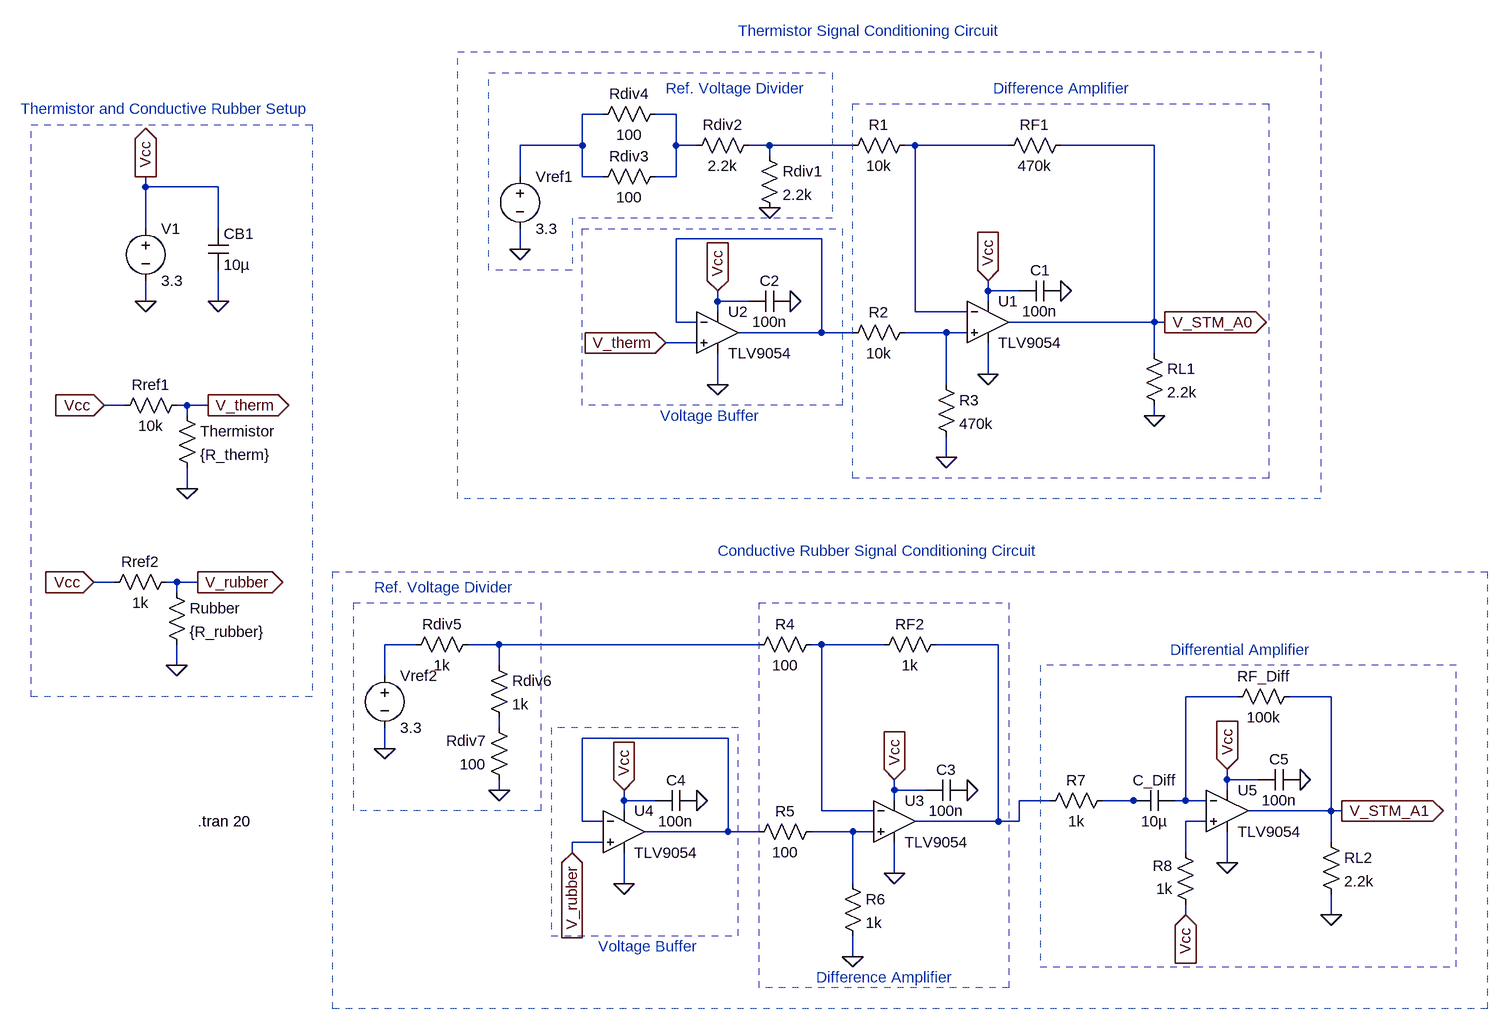
[diagram p0: schematic complete_circuit.asc]
complete_circuit.asc, the LTspice schematic file:
Version 4
SHEET 1 1320 1188
WIRE -176 -192 -208 -192
WIRE -64 -192 -96 -192
WIRE -208 -144 -208 -192
WIRE -208 -144 -304 -144
WIRE -64 -144 -64 -192
WIRE -32 -144 -64 -144
WIRE 80 -144 48 -144
WIRE 208 -144 80 -144
WIRE 304 -144 288 -144
WIRE 448 -144 304 -144
WIRE 672 -144 528 -144
WIRE 80 -128 80 -144
WIRE -304 -96 -304 -144
WIRE -208 -96 -208 -144
WIRE -176 -96 -208 -96
WIRE -64 -96 -64 -144
WIRE -64 -96 -96 -96
WIRE -880 -80 -880 -96
WIRE -768 -80 -880 -80
WIRE -880 -16 -880 -80
WIRE -768 -16 -768 -80
WIRE 160 0 -64 0
WIRE -304 16 -304 -16
WIRE 416 80 416 64
WIRE 464 80 416 80
WIRE -880 96 -880 64
WIRE -768 96 -768 48
WIRE 0 96 0 80
WIRE 48 96 0 96
WIRE 416 96 416 80
WIRE 0 112 0 96
WIRE 304 112 304 -144
WIRE 384 112 304 112
WIRE -64 128 -64 0
WIRE -32 128 -64 128
WIRE 672 128 672 -144
WIRE 672 128 448 128
WIRE 688 128 672 128
WIRE 160 144 160 0
WIRE 160 144 32 144
WIRE 208 144 160 144
WIRE 352 144 288 144
WIRE 384 144 352 144
WIRE -32 160 -80 160
WIRE 672 176 672 128
WIRE 416 208 416 160
WIRE 0 224 0 176
WIRE 352 224 352 144
WIRE -912 256 -944 256
WIRE -816 256 -832 256
WIRE -784 256 -816 256
WIRE -816 272 -816 256
WIRE 672 272 672 256
WIRE 352 336 352 304
WIRE -816 384 -816 352
WIRE -928 528 -960 528
WIRE -832 528 -848 528
WIRE -800 528 -832 528
WIRE -832 544 -832 528
WIRE -464 624 -512 624
WIRE -336 624 -384 624
WIRE 64 624 -336 624
WIRE 160 624 144 624
WIRE 256 624 160 624
WIRE 432 624 336 624
WIRE -832 656 -832 624
WIRE -336 656 -336 624
WIRE -512 672 -512 624
WIRE 800 704 720 704
WIRE 944 704 880 704
WIRE -336 752 -336 736
WIRE 16 768 -208 768
WIRE -512 784 -512 752
WIRE 784 832 784 816
WIRE 832 832 784 832
WIRE -336 848 -336 832
WIRE 272 848 272 832
WIRE 320 848 272 848
WIRE 784 848 784 832
WIRE -144 864 -144 848
WIRE -96 864 -144 864
WIRE 272 864 272 848
WIRE 512 864 464 864
WIRE 640 864 592 864
WIRE 656 864 640 864
WIRE 720 864 720 704
WIRE 720 864 704 864
WIRE 752 864 720 864
WIRE -144 880 -144 864
WIRE 160 880 160 624
WIRE 240 880 160 880
WIRE 944 880 944 704
WIRE 944 880 816 880
WIRE 960 880 944 880
WIRE -208 896 -208 768
WIRE -176 896 -208 896
WIRE 432 896 432 624
WIRE 432 896 304 896
WIRE 464 896 464 864
WIRE 464 896 432 896
WIRE 752 896 720 896
WIRE 16 912 16 768
WIRE 16 912 -112 912
WIRE 64 912 16 912
WIRE 208 912 144 912
WIRE 240 912 208 912
WIRE -176 928 -224 928
WIRE 944 928 944 880
WIRE -224 944 -224 928
WIRE 720 944 720 896
WIRE 784 960 784 912
WIRE 272 976 272 928
WIRE -144 992 -144 944
WIRE 208 992 208 912
WIRE 720 1040 720 1024
WIRE 944 1040 944 1008
WIRE 208 1104 208 1072
FLAG -880 96 0
FLAG -768 96 0
FLAG -880 -96 Vcc
IOPIN -880 -96 Out
FLAG 416 208 0
FLAG 416 64 Vcc
IOPIN 416 64 In
FLAG 528 80 0
FLAG 672 272 0
FLAG -304 16 0
FLAG 688 128 V_STM_A0
IOPIN 688 128 Out
FLAG 352 336 0
FLAG 0 224 0
FLAG 0 80 Vcc
IOPIN 0 80 In
FLAG 112 96 0
FLAG 80 -48 0
FLAG -944 256 Vcc
IOPIN -944 256 In
FLAG -816 384 0
FLAG -784 256 V_therm
IOPIN -784 256 Out
FLAG -80 160 V_therm
IOPIN -80 160 In
FLAG -960 528 Vcc
IOPIN -960 528 In
FLAG -832 656 0
FLAG -800 528 V_rubber
IOPIN -800 528 Out
FLAG 272 976 0
FLAG 272 832 Vcc
IOPIN 272 832 In
FLAG 384 848 0
FLAG -512 784 0
FLAG 208 1104 0
FLAG -144 992 0
FLAG -144 848 Vcc
IOPIN -144 848 In
FLAG -32 864 0
FLAG -224 944 V_rubber
IOPIN -224 944 In
FLAG -336 848 0
FLAG 784 960 0
FLAG 784 816 Vcc
IOPIN 784 816 In
FLAG 896 832 0
FLAG 960 880 V_STM_A1
IOPIN 960 880 Out
FLAG 944 1040 0
FLAG 720 1040 Vcc
IOPIN 720 1040 In
SYMBOL voltage -880 -32 R0
SYMATTR InstName V1
SYMATTR Value 3.3
SYMBOL cap -784 -16 R0
SYMATTR InstName CB1
SYMATTR Value 10µ
SYMBOL cap 464 64 M90
WINDOW 0 0 32 VBottom 2
WINDOW 3 32 32 VTop 2
SYMATTR InstName C1
SYMATTR Value 100n
SYMBOL TLV9054 416 128 R0
SYMATTR InstName U1
SYMBOL res 656 160 R0
SYMATTR InstName RL1
SYMATTR Value 2.2k
SYMBOL res 64 -144 R0
SYMATTR InstName Rdiv1
SYMATTR Value 2.2k
SYMBOL voltage -304 -112 R0
WINDOW 123 0 0 Left 0
WINDOW 39 0 0 Left 0
SYMATTR InstName Vref1
SYMATTR Value 3.3
SYMBOL res 64 -160 R90
WINDOW 0 0 56 VBottom 2
WINDOW 3 32 56 VTop 2
SYMATTR InstName Rdiv2
SYMATTR Value 2.2k
SYMBOL res 304 -160 R90
WINDOW 0 0 56 VBottom 2
WINDOW 3 32 56 VTop 2
SYMATTR InstName R1
SYMATTR Value 10k
SYMBOL res 544 -160 R90
WINDOW 0 0 56 VBottom 2
WINDOW 3 32 56 VTop 2
SYMATTR InstName RF1
SYMATTR Value 470k
SYMBOL res 304 128 R90
WINDOW 0 0 56 VBottom 2
WINDOW 3 32 56 VTop 2
SYMATTR InstName R2
SYMATTR Value 10k
SYMBOL res 336 208 R0
SYMATTR InstName R3
SYMATTR Value 470k
SYMBOL res -80 -208 R90
WINDOW 0 0 56 VBottom 2
WINDOW 3 32 56 VTop 2
SYMATTR InstName Rdiv4
SYMATTR Value 100
SYMBOL res -80 -112 R90
WINDOW 0 0 56 VBottom 2
WINDOW 3 32 56 VTop 2
SYMATTR InstName Rdiv3
SYMATTR Value 100
SYMBOL cap 48 80 M90
WINDOW 0 0 32 VBottom 2
WINDOW 3 32 32 VTop 2
SYMATTR InstName C2
SYMATTR Value 100n
SYMBOL TLV9054 0 144 R0
SYMATTR InstName U2
SYMBOL res -816 240 R90
WINDOW 0 0 56 VBottom 2
WINDOW 3 32 56 VTop 2
SYMATTR InstName Rref1
SYMATTR Value 10k
SYMBOL res -832 256 R0
SYMATTR InstName Thermistor
SYMATTR Value {R_therm}
SYMBOL res -832 512 R90
WINDOW 0 0 56 VBottom 2
WINDOW 3 32 56 VTop 2
SYMATTR InstName Rref2
SYMATTR Value 1k
SYMBOL res -848 528 R0
SYMATTR InstName Rubber
SYMATTR Value {R_rubber}
SYMBOL cap 320 832 M90
WINDOW 0 0 32 VBottom 2
WINDOW 3 32 32 VTop 2
SYMATTR InstName C3
SYMATTR Value 100n
SYMBOL TLV9054 272 896 R0
SYMATTR InstName U3
SYMBOL voltage -512 656 R0
WINDOW 123 0 0 Left 0
WINDOW 39 0 0 Left 0
SYMATTR InstName Vref2
SYMATTR Value 3.3
SYMBOL res 160 608 R90
WINDOW 0 0 56 VBottom 2
WINDOW 3 32 56 VTop 2
SYMATTR InstName R4
SYMATTR Value 100
SYMBOL res 352 608 R90
WINDOW 0 0 56 VBottom 2
WINDOW 3 32 56 VTop 2
SYMATTR InstName RF2
SYMATTR Value 1k
SYMBOL res 160 896 R90
WINDOW 0 0 56 VBottom 2
WINDOW 3 32 56 VTop 2
SYMATTR InstName R5
SYMATTR Value 100
SYMBOL res 192 976 R0
SYMATTR InstName R6
SYMATTR Value 1k
SYMBOL cap -96 848 M90
WINDOW 0 0 32 VBottom 2
WINDOW 3 32 32 VTop 2
SYMATTR InstName C4
SYMATTR Value 100n
SYMBOL TLV9054 -144 912 R0
SYMATTR InstName U4
SYMBOL res -368 608 R90
WINDOW 0 0 56 VBottom 2
WINDOW 3 32 56 VTop 2
SYMATTR InstName Rdiv5
SYMATTR Value 1k
SYMBOL res -352 640 R0
SYMATTR InstName Rdiv6
SYMATTR Value 1k
SYMBOL res -320 848 R180
WINDOW 0 36 76 Left 2
WINDOW 3 36 40 Left 2
SYMATTR InstName Rdiv7
SYMATTR Value 100
SYMBOL cap 832 816 M90
WINDOW 0 0 32 VBottom 2
WINDOW 3 32 32 VTop 2
SYMATTR InstName C5
SYMATTR Value 100n
SYMBOL TLV9054 784 880 R0
SYMATTR InstName U5
SYMBOL res 608 848 R90
WINDOW 0 0 56 VBottom 2
WINDOW 3 32 56 VTop 2
SYMATTR InstName R7
SYMATTR Value 1k
SYMBOL cap 704 848 R90
WINDOW 0 0 32 VBottom 2
WINDOW 3 32 32 VTop 2
SYMATTR InstName C_Diff
SYMATTR Value 10µ
SYMBOL res 736 1040 R180
WINDOW 0 36 76 Left 2
WINDOW 3 36 40 Left 2
SYMATTR InstName R8
SYMATTR Value 1k
SYMBOL res 896 688 R90
WINDOW 0 0 56 VBottom 2
WINDOW 3 32 56 VTop 2
SYMATTR InstName RF_Diff
SYMATTR Value 100k
SYMBOL res 928 912 R0
SYMATTR InstName RL2
SYMATTR Value 2.2k
TEXT -800 896 Left 2 !.tran 20
TEXT 32 -320 Left 2 ;Thermistor Signal Conditioning Circuit
TEXT 0 480 Left 2 ;Conductive Rubber Signal Conditioning Circuit
TEXT -80 -232 Left 2 ;Ref. Voltage Divider
TEXT -528 536 Left 2 ;Ref. Voltage Divider
TEXT -88 272 Left 2 ;Voltage Buffer
TEXT -184 1088 Left 2 ;Voltage Buffer
TEXT 424 -232 Left 2 ;Difference Amplifier
TEXT 152 1136 Left 2 ;Difference Amplifier
TEXT 696 632 Left 2 ;Differential Amplifier
TEXT -1072 -200 Left 2 ;Thermistor and Conductive Rubber Setup
LINE Normal -224 48 -352 48 2
LINE Normal -224 -32 -224 48 2
LINE Normal 176 -32 -224 -32 2
LINE Normal 176 -256 176 -32 2
LINE Normal -352 -256 176 -256 2
LINE Normal -352 48 -352 -256 2
RECTANGLE Normal -624 704 -1056 -176 1
RECTANGLE Normal 192 256 -208 -16 2
RECTANGLE Normal -256 1072 32 752 2
RECTANGLE Normal 848 368 208 -208 2
RECTANGLE Normal -272 880 -560 560 2
RECTANGLE Normal 448 1152 64 560 2
RECTANGLE Normal 496 1120 1136 656 2
RECTANGLE Normal 928 400 -400 -288 1
RECTANGLE Normal 1184 1184 -592 512 1

The netlist it stands for:
* complete_circuit.asc
V1 Vcc 0 3.3
CB1 Vcc 0 10µ
C1 Vcc 0 100n
* U1: TLV9054 (symbol TLV9054 not available, pins judged from their places): In+=N006 In-=N004 V+=Vcc V-=0 OUT=V_STM_A0
RL1 V_STM_A0 0 2.2k
Rdiv1 N003 0 2.2k
Vref1 N001 0 3.3
Rdiv2 N003 N002 2.2k
R1 N004 N003 10k
RF1 V_STM_A0 N004 470k
R2 N006 N005 10k
R3 N006 0 470k
Rdiv4 N002 N001 100
Rdiv3 N002 N001 100
C2 Vcc 0 100n
* U2: TLV9054 (symbol TLV9054 not available, pins judged from their places): In+=V_therm In-=N005 V+=Vcc V-=0 OUT=N005
Rref1 V_therm Vcc 10k
R§Thermistor V_therm 0 {R_therm}
Rref2 V_rubber Vcc 1k
Rubber V_rubber 0 {R_rubber}
C3 Vcc 0 100n
* U3: TLV9054 (symbol TLV9054 not available, pins judged from their places): In+=N016 In-=N009 V+=Vcc V-=0 OUT=N010
Vref2 N007 0 3.3
R4 N009 N008 100
RF2 N010 N009 1k
R5 N016 N013 100
R6 N016 0 1k
C4 Vcc 0 100n
* U4: TLV9054 (symbol TLV9054 not available, pins judged from their places): In+=V_rubber In-=N013 V+=Vcc V-=0 OUT=N013
Rdiv5 N008 N007 1k
Rdiv6 N008 N012 1k
Rdiv7 0 N012 100
C5 Vcc 0 100n
* U5: TLV9054 (symbol TLV9054 not available, pins judged from their places): In+=N015 In-=N011 V+=Vcc V-=0 OUT=V_STM_A1
R7 N014 N010 1k
C_Diff N011 N014 10µ
R8 Vcc N015 1k
RF_Diff V_STM_A1 N011 100k
RL2 V_STM_A1 0 2.2k
.tran 20
* Thermistor Signal Conditioning Circuit
* Conductive Rubber Signal Conditioning Circuit
* Ref. Voltage Divider
* Ref. Voltage Divider
* Voltage Buffer
* Voltage Buffer
* Difference Amplifier
* Difference Amplifier
* Differential Amplifier
* Thermistor and Conductive Rubber Setup
.backanno
.end